# Altium project PogoPinHandBoard.PrjPCB
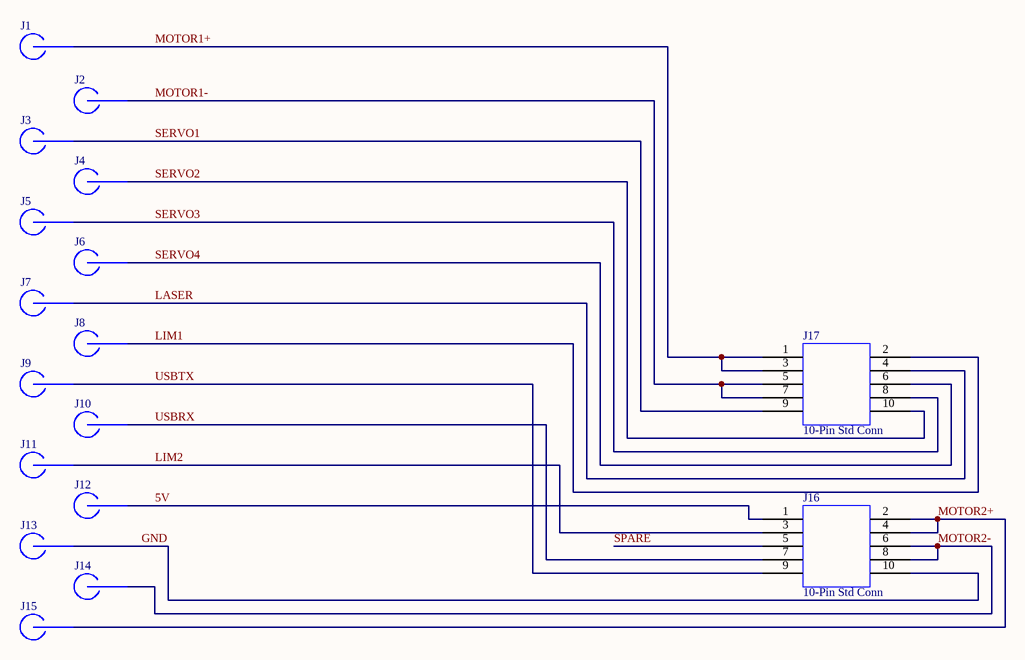
[diagram p0: Pads.SchDoc]
1 sheet, 17 parts. Net scope: global (net labels, ports and power ports of the same name join across sheets).
Board file: PogoPinPadSide.PcbDoc

## Sheet Pads.SchDoc
size A

### Parts
J1  PogoPinPad  (value not drawn)
J2  PogoPinPad  (value not drawn)
J3  PogoPinPad  (value not drawn)
J4  PogoPinPad  (value not drawn)
J5  PogoPinPad  (value not drawn)
J6  PogoPinPad  (value not drawn)
J7  PogoPinPad  (value not drawn)
J8  PogoPinPad  (value not drawn)
J9  PogoPinPad  (value not drawn)
J10  PogoPinPad  (value not drawn)
J11  PogoPinPad  (value not drawn)
J12  PogoPinPad  (value not drawn)
J13  PogoPinPad  (value not drawn)
J14  PogoPinPad  (value not drawn)
J15  PogoPinPad  (value not drawn)
J16  10-Pin Std Conn  [FTSH-105-01-F-DV]
J17  10-Pin Std Conn  [FTSH-105-01-F-DV]

### Nets
5V: J12.1(Pin) J16.1(Pin)
GND: J13.1(Pin) J16.10(Pin)
LASER: J7.1(Pin) J17.4(Pin)
LIM1: J8.1(Pin) J17.2(Pin)
LIM2: J11.1(Pin) J16.3(Pin)
MOTOR1+: J1.1(Pin) J17.1(Pin) J17.3(Pin)
MOTOR1-: J2.1(Pin) J17.5(Pin) J17.7(Pin)
MOTOR2+: J15.1(Pin) J16.2(Pin) J16.4(Pin)
MOTOR2-: J14.1(Pin) J16.6(Pin) J16.8(Pin)
SERVO1: J3.1(Pin) J17.9(Pin)
SERVO2: J4.1(Pin) J17.10(Pin)
SERVO3: J5.1(Pin) J17.8(Pin)
SERVO4: J6.1(Pin) J17.6(Pin)
SPARE: J16.5(Pin)
USBRX: J10.1(Pin) J16.7(Pin)
USBTX: J9.1(Pin) J16.9(Pin)